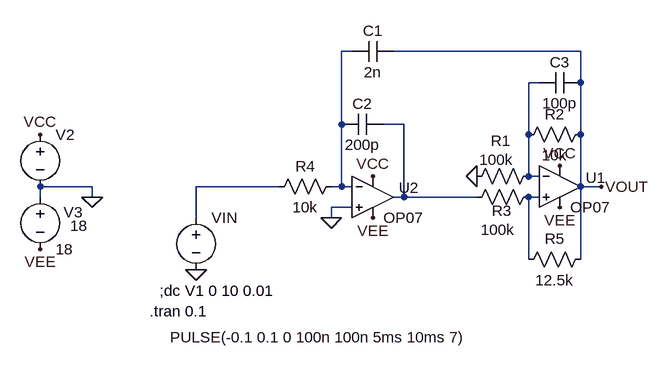
[diagram p0: schematic Draft35.asc]
Draft35.asc, the LTspice schematic file:
Version 4
SHEET 1 880 680
WIRE 96 -112 80 -112
WIRE 448 -112 160 -112
WIRE 384 -64 368 -64
WIRE 448 -64 448 -112
WIRE 80 0 80 -112
WIRE 176 0 144 0
WIRE 368 16 368 -64
WIRE 448 16 448 -64
WIRE 368 80 368 16
WIRE 384 80 368 80
WIRE -304 96 -384 96
WIRE -16 96 -144 96
WIRE 80 96 80 0
WIRE 80 96 64 96
WIRE 96 96 80 96
WIRE 448 96 448 16
WIRE 480 96 448 96
WIRE -384 112 -384 96
WIRE -304 112 -304 96
WIRE 176 112 176 0
WIRE 176 112 160 112
WIRE 288 112 176 112
WIRE 384 112 368 112
WIRE 96 128 64 128
WIRE -144 144 -144 96
WIRE 64 144 64 128
WIRE 368 208 368 112
WIRE 448 208 448 96
FLAG -144 224 0
FLAG -304 112 0
FLAG 480 96 VOUT
FLAG -384 16 VCC
FLAG 416 64 VCC
FLAG -384 192 VEE
FLAG 416 128 VEE
FLAG 288 80 0
FLAG 128 80 VCC
FLAG 128 144 VEE
FLAG 64 144 0
SYMBOL voltage -144 128 R0
WINDOW 123 0 0 Left 0
WINDOW 39 0 0 Left 0
WINDOW 3 -40 200 Left 2
SYMATTR Value PULSE(-0.1 0.1 0 100n 100n 5ms 10ms 7)
SYMATTR InstName VIN
SYMBOL OpAmps\\OP07 416 32 R0
WINDOW 0 40 50 Left 2
SYMATTR InstName U1
SYMBOL voltage -384 0 R0
WINDOW 123 0 0 Left 0
WINDOW 39 0 0 Left 0
WINDOW 3 46 156 Left 2
SYMATTR Value 18
SYMATTR InstName V2
SYMBOL voltage -384 96 R0
WINDOW 123 0 0 Left 0
WINDOW 39 0 0 Left 0
WINDOW 0 36 39 Left 2
SYMATTR InstName V3
SYMATTR Value 18
SYMBOL res 384 64 R90
WINDOW 0 -23 59 VBottom 2
WINDOW 3 -25 66 VTop 2
SYMATTR InstName R1
SYMATTR Value 100k
SYMBOL res 384 96 R90
WINDOW 0 53 57 VBottom 2
WINDOW 3 51 63 VTop 2
SYMATTR InstName R3
SYMATTR Value 100k
SYMBOL res 464 192 R90
WINDOW 0 0 56 VBottom 2
WINDOW 3 32 56 VTop 2
SYMATTR InstName R5
SYMATTR Value 12.5k
SYMBOL OpAmps\\OP07 128 48 R0
WINDOW 0 40 50 Left 2
SYMATTR InstName U2
SYMBOL cap 160 -128 R90
WINDOW 0 0 32 VBottom 2
WINDOW 3 32 32 VTop 2
SYMATTR InstName C1
SYMATTR Value 2n
SYMBOL res 80 80 R90
WINDOW 0 0 56 VBottom 2
WINDOW 3 32 56 VTop 2
SYMATTR InstName R4
SYMATTR Value 10k
SYMBOL res 464 0 R90
WINDOW 0 0 56 VBottom 2
WINDOW 3 32 56 VTop 2
SYMATTR InstName R2
SYMATTR Value 10k
SYMBOL cap 448 -80 R90
WINDOW 0 0 32 VBottom 2
WINDOW 3 32 32 VTop 2
SYMATTR InstName C3
SYMATTR Value 100p
SYMBOL cap 144 -16 R90
WINDOW 0 0 32 VBottom 2
WINDOW 3 32 32 VTop 2
SYMATTR InstName C2
SYMATTR Value 200p
TEXT -200 256 Left 2 !;dc V1 0 10 0.01
TEXT -216 288 Left 2 !.tran 0.1

The netlist it stands for:
* Draft35.asc
VIN N004 0 PULSE(-0.1 0.1 0 100n 100n 5ms 10ms 7)
XU1 N005 N002 VCC VEE VOUT LT1001  ; OP07, pins In+ In- V+ V- OUT
V2 VCC 0 18
V3 0 VEE 18
R1 N002 0 100k
R3 N005 N003 100k
R5 VOUT N005 12.5k
XU2 0 N001 VCC VEE N003 LT1001  ; OP07, pins In+ In- V+ V- OUT
C1 VOUT N001 2n
R4 N001 N004 10k
R2 VOUT N002 10k
C3 VOUT N002 100p
C2 N003 N001 200p
;dc V1 0 10 0.01
.tran 0.1
.lib LTC.lib
.backanno
.end